# Altium schematic sheet 14-CONNECTOR.SchDoc
size B
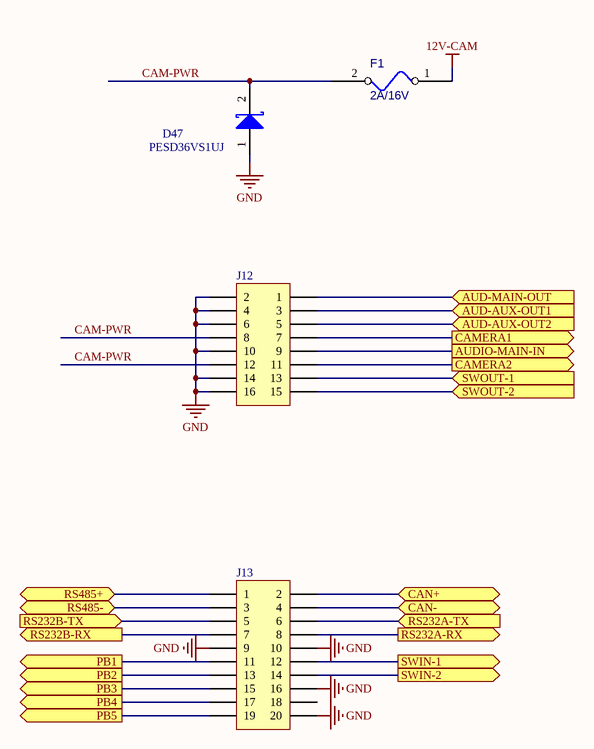
[diagram p0: 14-CONNECTOR.SchDoc]

## Parts
D47  PESD36VS1UJ  [SOD323]
F1  2A/16V  [2920]
J12  Header 8X2  [3030WR-S-2*8P]  (value not drawn)
J13  Header 10X2  [3030WR-S-2*10P]  (value not drawn)

## Ports
AUD-AUX-OUT1 (in), AUD-AUX-OUT2 (in), AUD-MAIN-OUT (in), AUDIO-MAIN-IN (out), CAMERA1 (out), CAMERA2 (out), CAN+ (bidir), CAN- (bidir), PB1 (out), PB2 (out), PB3 (out), PB4 (out), PB5 (out), RS232A-RX (out), RS232A-TX (in), RS232B-RX (out), RS232B-TX (in), RS485+ (bidir), RS485- (bidir), SWIN-1 (out), SWIN-2 (out), SWOUT-1 (in), SWOUT-2 (in)

## Nets
12V-CAM: F1.1
GND: D47.1(A) J12.2 J12.4 J12.6 J12.10 J12.14 J12.16 J13.9 J13.10 J13.16 J13.20
AUD-AUX-OUT1: J12.3 ; port AUD-AUX-OUT1
AUD-AUX-OUT2: J12.5 ; port AUD-AUX-OUT2
AUD-MAIN-OUT: J12.1 ; port AUD-MAIN-OUT
AUDIO-MAIN-IN: J12.9 ; port AUDIO-MAIN-IN
CAM-PWR: D47.2(K) F1.2 J12.8 J12.12
CAMERA1: J12.7 ; port CAMERA1
CAMERA2: J12.11 ; port CAMERA2
CAN+: J13.2 ; port CAN+
CAN-: J13.4 ; port CAN-
PB1: J13.11 ; port PB1
PB2: J13.13 ; port PB2
PB3: J13.15 ; port PB3
PB4: J13.17 ; port PB4
PB5: J13.19 ; port PB5
RS232A-RX: J13.8 ; port RS232A-RX
RS232A-TX: J13.6 ; port RS232A-TX
RS232B-RX: J13.7 ; port RS232B-RX
RS232B-TX: J13.5 ; port RS232B-TX
RS485+: J13.1 ; port RS485+
RS485-: J13.3 ; port RS485-
SWIN-1: J13.12 ; port SWIN-1
SWIN-2: J13.14 ; port SWIN-2
SWOUT-1: J12.13 ; port SWOUT-1
SWOUT-2: J12.15 ; port SWOUT-2

Not connected (* = marked no-connect by the designer): J13 18

## Library data of the parts
D47 = Diode 11DQ03: Schottky Rectifier
F1 = 2A_32VDC_0467-002
J12 = Header 8X2: Header, 8-Pin, Dual row; LatestRevisionDate: 17-Jul-2002; LatestRevisionNote: Re-released for DXP Platform.; Publisher: Altium Limited
J13 = Header 10X2: Header, 10-Pin, Dual row; LatestRevisionDate: 17-Jul-2002; LatestRevisionNote: Re-released for DXP Platform.; Publisher: Altium Limited